# Altium schematic sheet AccelFilters.SchDoc
size A
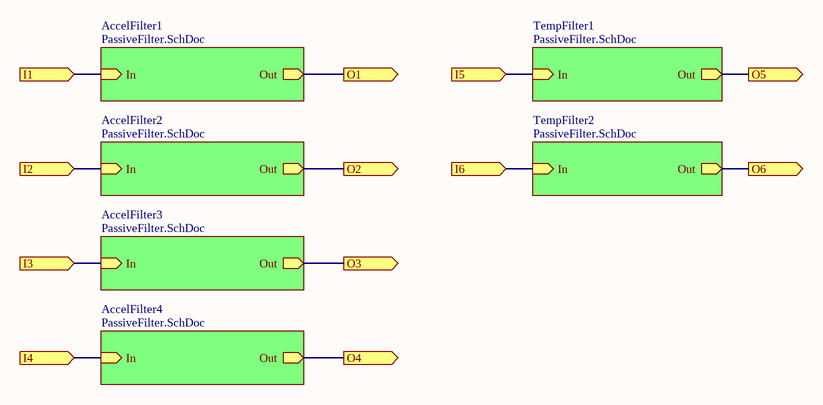
[diagram p0: AccelFilters.SchDoc]

## Sub-sheets
AccelFilter1 = PassiveFilter.SchDoc: Out (out), In (in)
AccelFilter2 = PassiveFilter.SchDoc: Out (out), In (in)
AccelFilter3 = PassiveFilter.SchDoc: In (in), Out (out)
AccelFilter4 = PassiveFilter.SchDoc: In (in), Out (out)
TempFilter1 = PassiveFilter.SchDoc: In (in), Out (out)
TempFilter2 = PassiveFilter.SchDoc: Out (out), In (in)

## Ports
I1 (in), I2 (in), I3 (in), I4 (in), I5 (in), I6 (in), O1 (out), O2 (out), O3 (out), O4 (out), O5 (out), O6 (out)

## Nets
I1: port I1, sheet AccelFilter1/In
I2: port I2, sheet AccelFilter2/In
I3: port I3, sheet AccelFilter3/In
I4: port I4, sheet AccelFilter4/In
I5: port I5, sheet TempFilter1/In
I6: port I6, sheet TempFilter2/In
O1: port O1, sheet AccelFilter1/Out
O2: port O2, sheet AccelFilter2/Out
O3: port O3, sheet AccelFilter3/Out
O4: port O4, sheet AccelFilter4/Out
O5: port O5, sheet TempFilter1/Out
O6: port O6, sheet TempFilter2/Out